# Altium schematic sheet TOP.SchDoc: TOP.SchDoc
size A4; Organization: Queen's Formula SAE; Address1: 130 Stuart St; Address2: Kingston K7L 2V9; Address3: Ontario; Address4: Canada; DocumentNumber: 1; Revision: 0; SheetNumber: 1; SheetTotal: 1
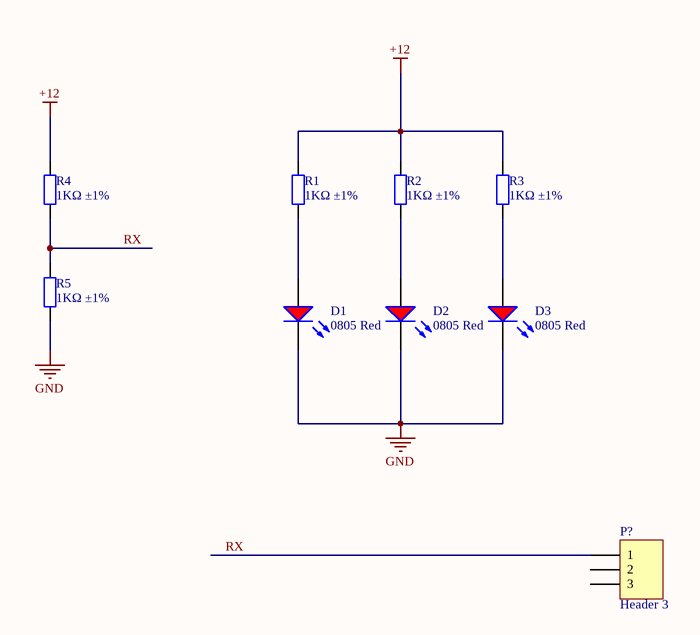
[diagram p0: TOP.SchDoc]

## Parts
D1  0805 Red  [0805_LED_S1]
D2  0805 Red  [0805_LED_S1]
D3  0805 Red  [0805_LED_S1]
P?  Header 3  [HDR1X3]
R1  1KΩ ±1%  [0805_R]
R2  1KΩ ±1%  [0805_R]
R3  1KΩ ±1%  [0805_R]
R4  1KΩ ±1%  [0805_R]
R5  1KΩ ±1%  [0805_R]

## Nets
+12: R1.2 R2.2 R3.2 R4.2
GND: D1.K D2.K D3.K R5.1
RX: P?.1 R4.1 R5.2
NetD1_A: D1.A R1.1
NetD2_A: D2.A R2.1
NetD3_A: D3.A R3.1

Not connected (* = marked no-connect by the designer): P? 2 3

## Notes on the sheet
- Title
- Size:
- Date:
- A4
- Number:
- Time:
- Revision:
- Sheet
- of
- File:

## Library data of the parts
D1-D3 = 0805 LED Red: LED; PartNumber: FC-2012HRK-620D; Manufacturer: Foshan NationStar Optoelectronics; ComponentLink1Description: 供应商链接; ComponentLink1URL: http://www.szlcsc.com/product/details_2668.html; Package: 0805; Supplier: LC; SuppliersPartNumber: C84256; Color: Red
P? = Header 3: Header, 3-Pin; LatestRevisionDate: 17-Jul-2002; LatestRevisionNote: Re-released for DXP Platform.; Publisher: Altium Limited
R1-R5 = 0805 1K (1001) 1%: Chip resistor; Manufacturer: Uniroyal Elec; PartNumber: 0805W8F1001T5E; Power: 1/8W; ComponentLink1Description: Supplier link; ComponentLink1URL: http://www.szlcsc.com/product/details_18201.html; Package: 0805; Supplier: LC; SuppliersPartNumber: C17513; Resistance: 1KΩ; Tolerance: 1%